# Altium schematic sheet 整板_大板_one.SchDoc
size A0
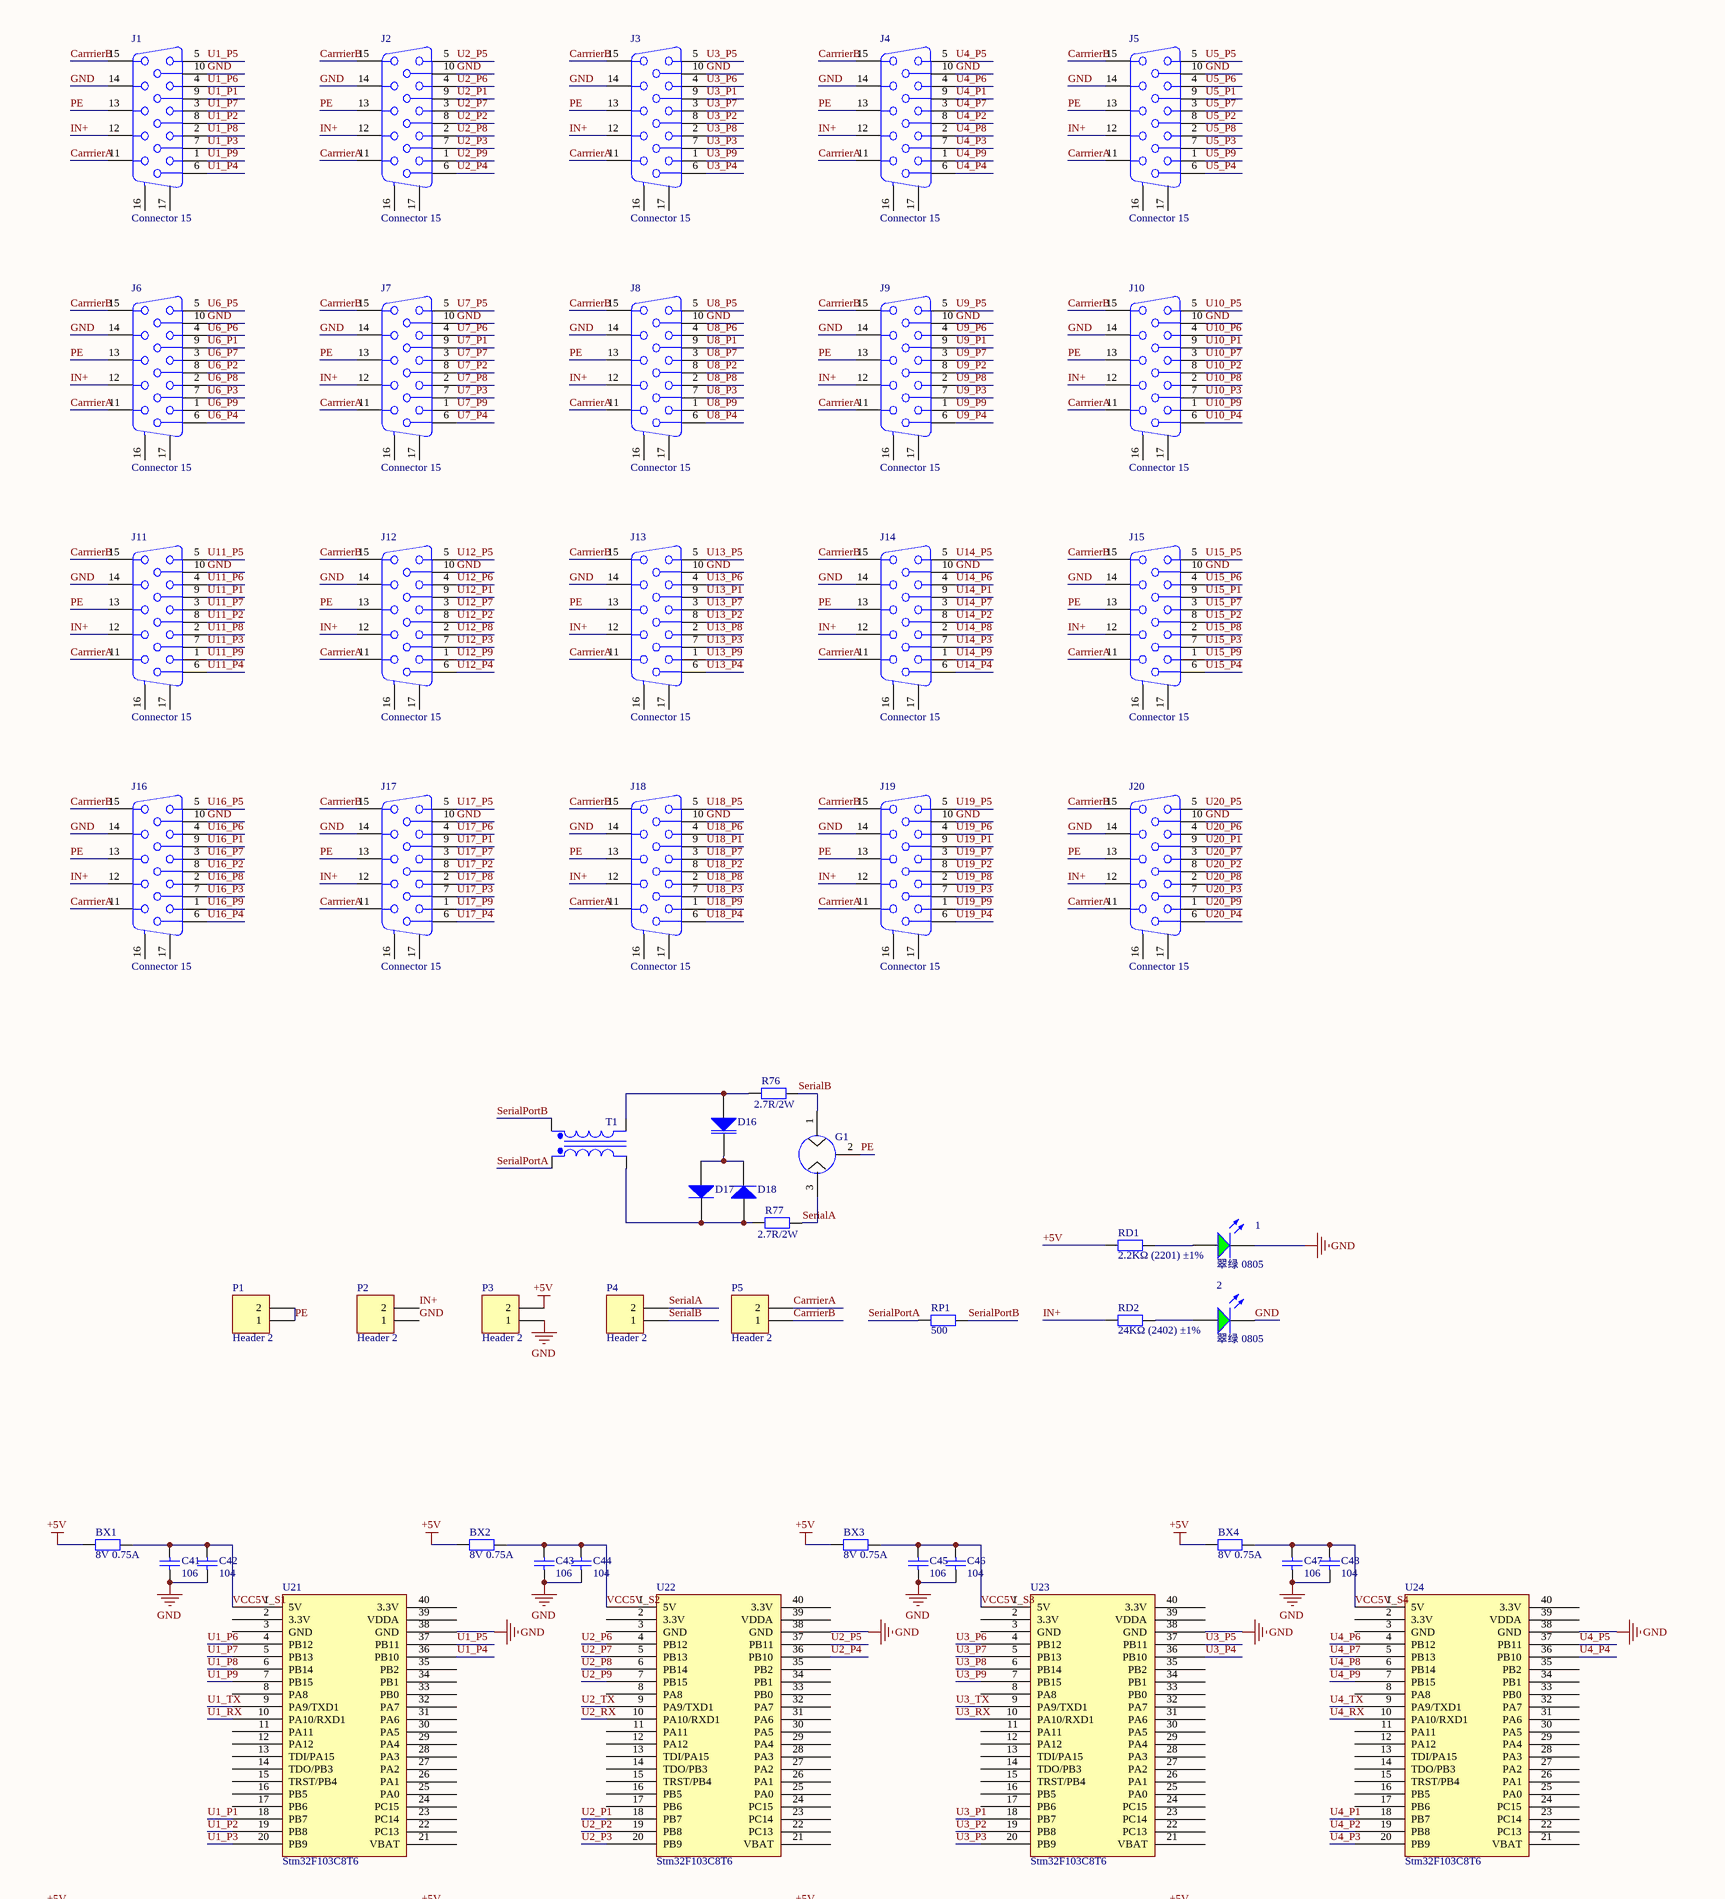
[diagram p0: 整板_大板_one.SchDoc, top left]
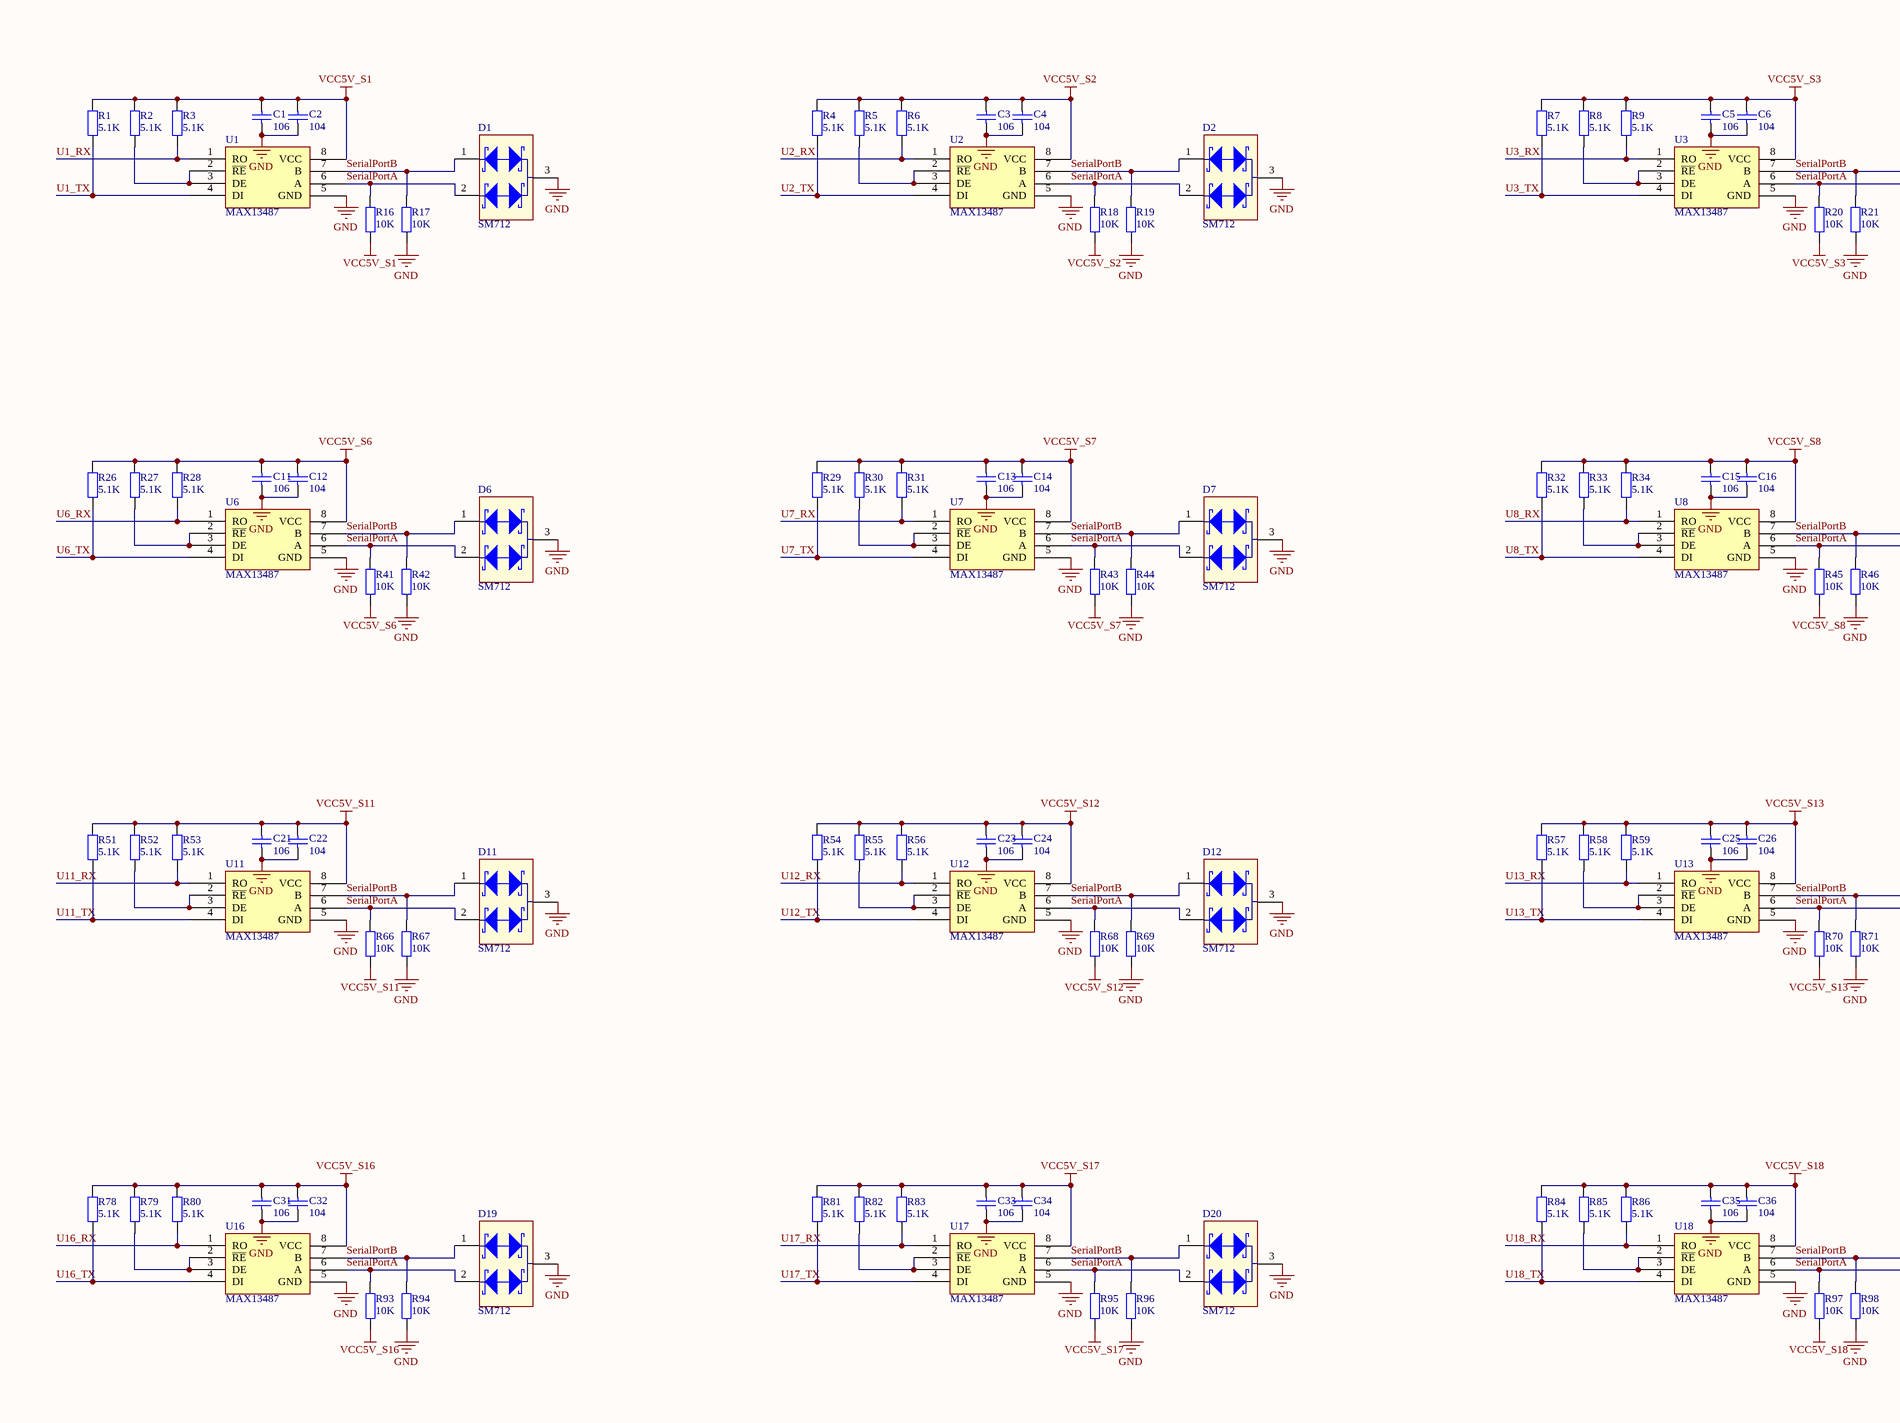
[diagram p1: 整板_大板_one.SchDoc, top middle]
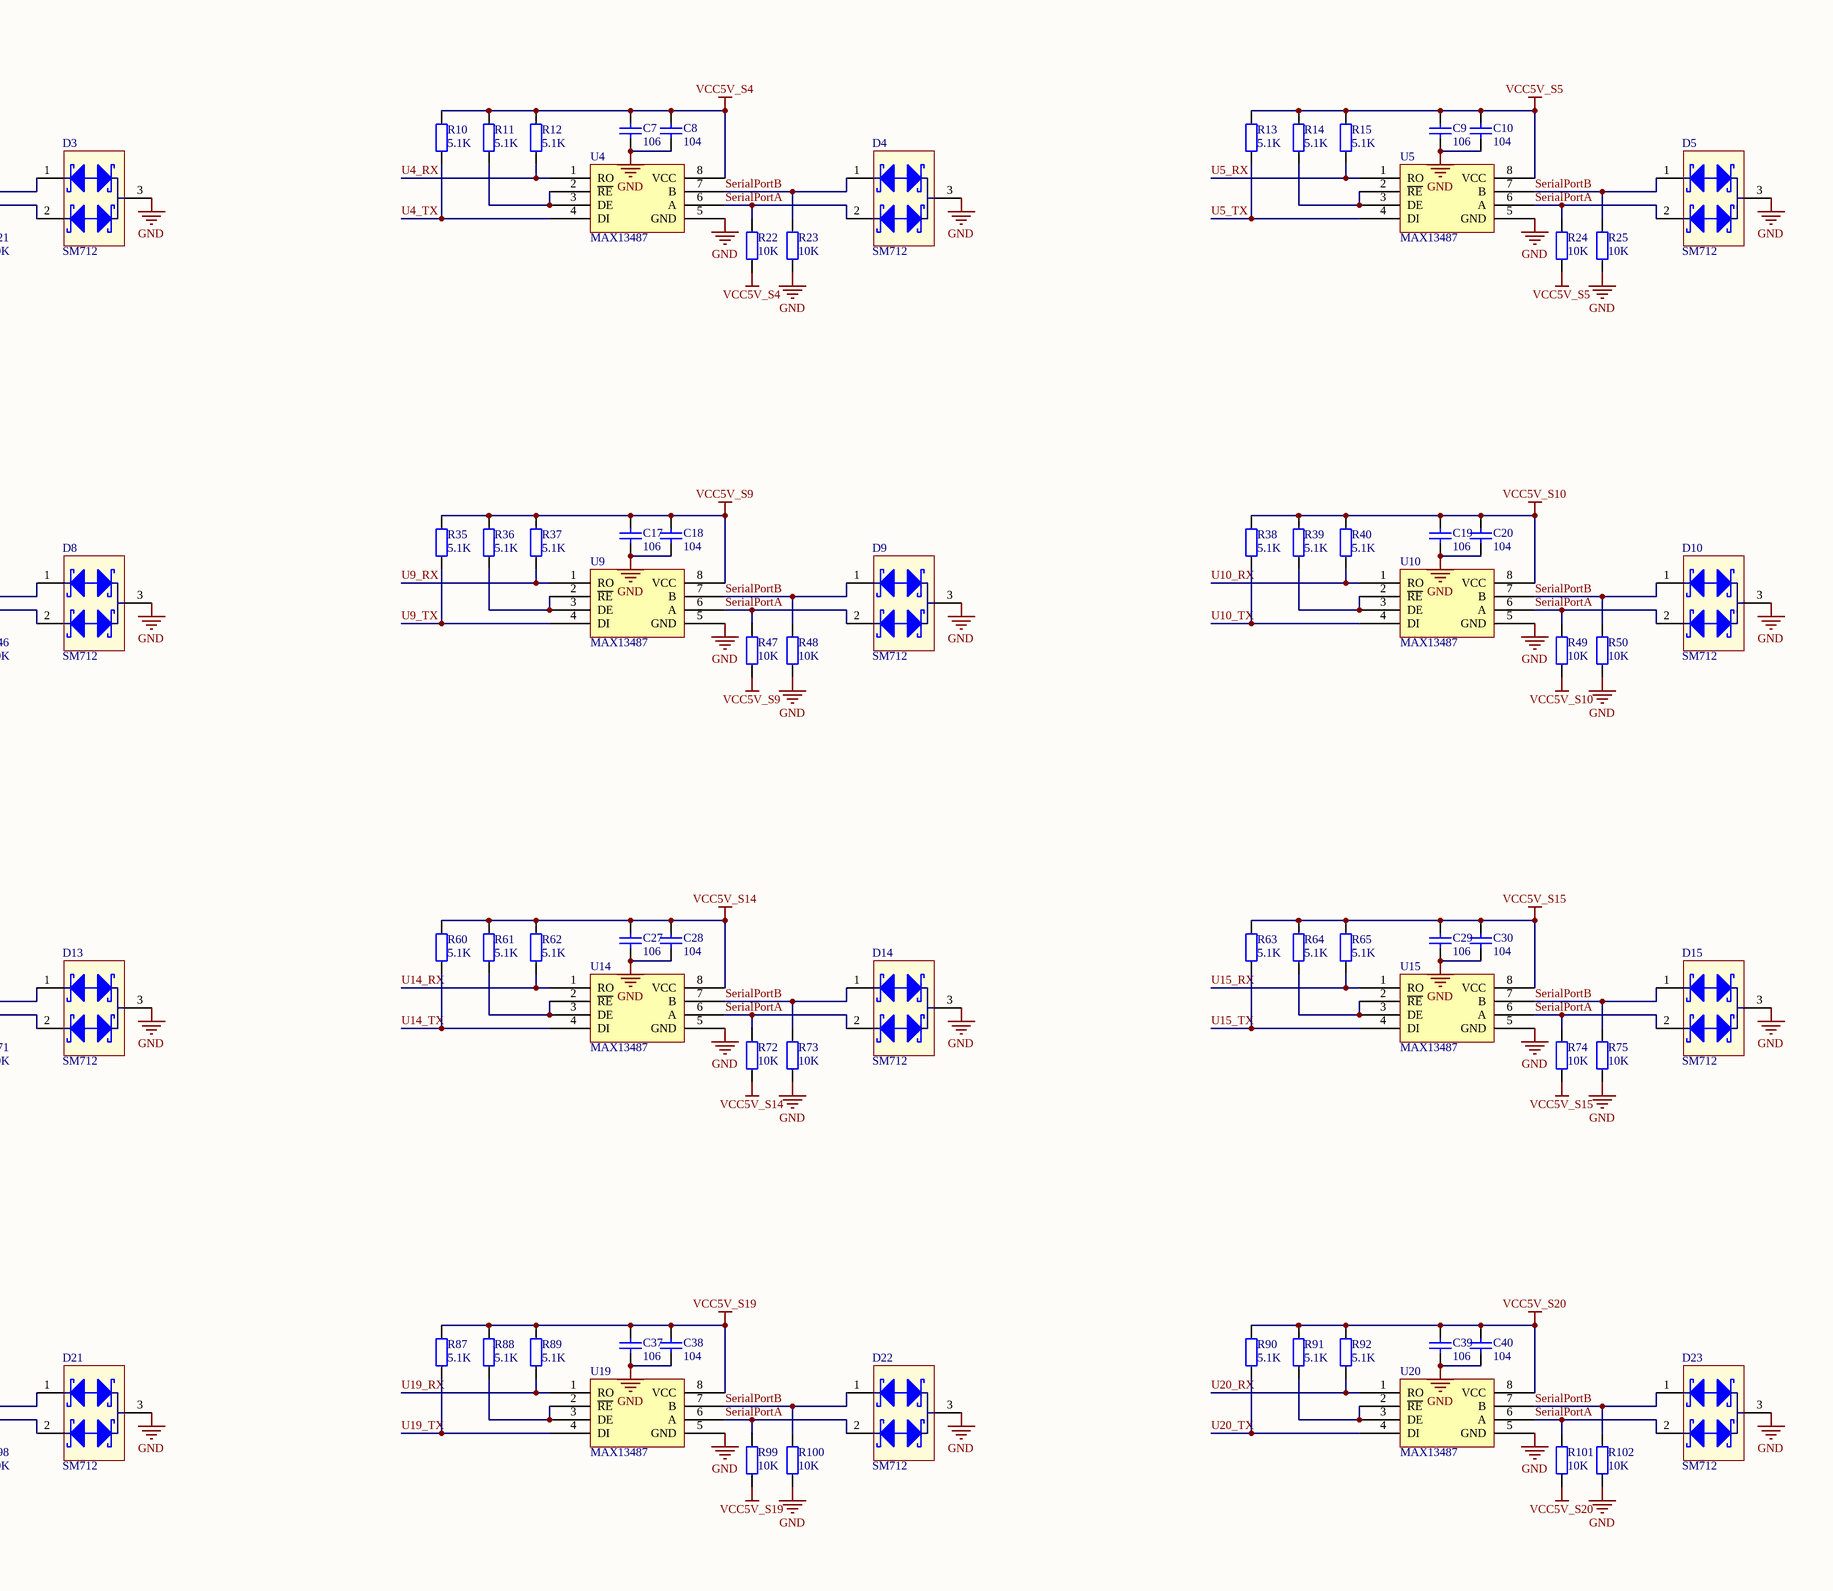
[diagram p2: 整板_大板_one.SchDoc, top right]
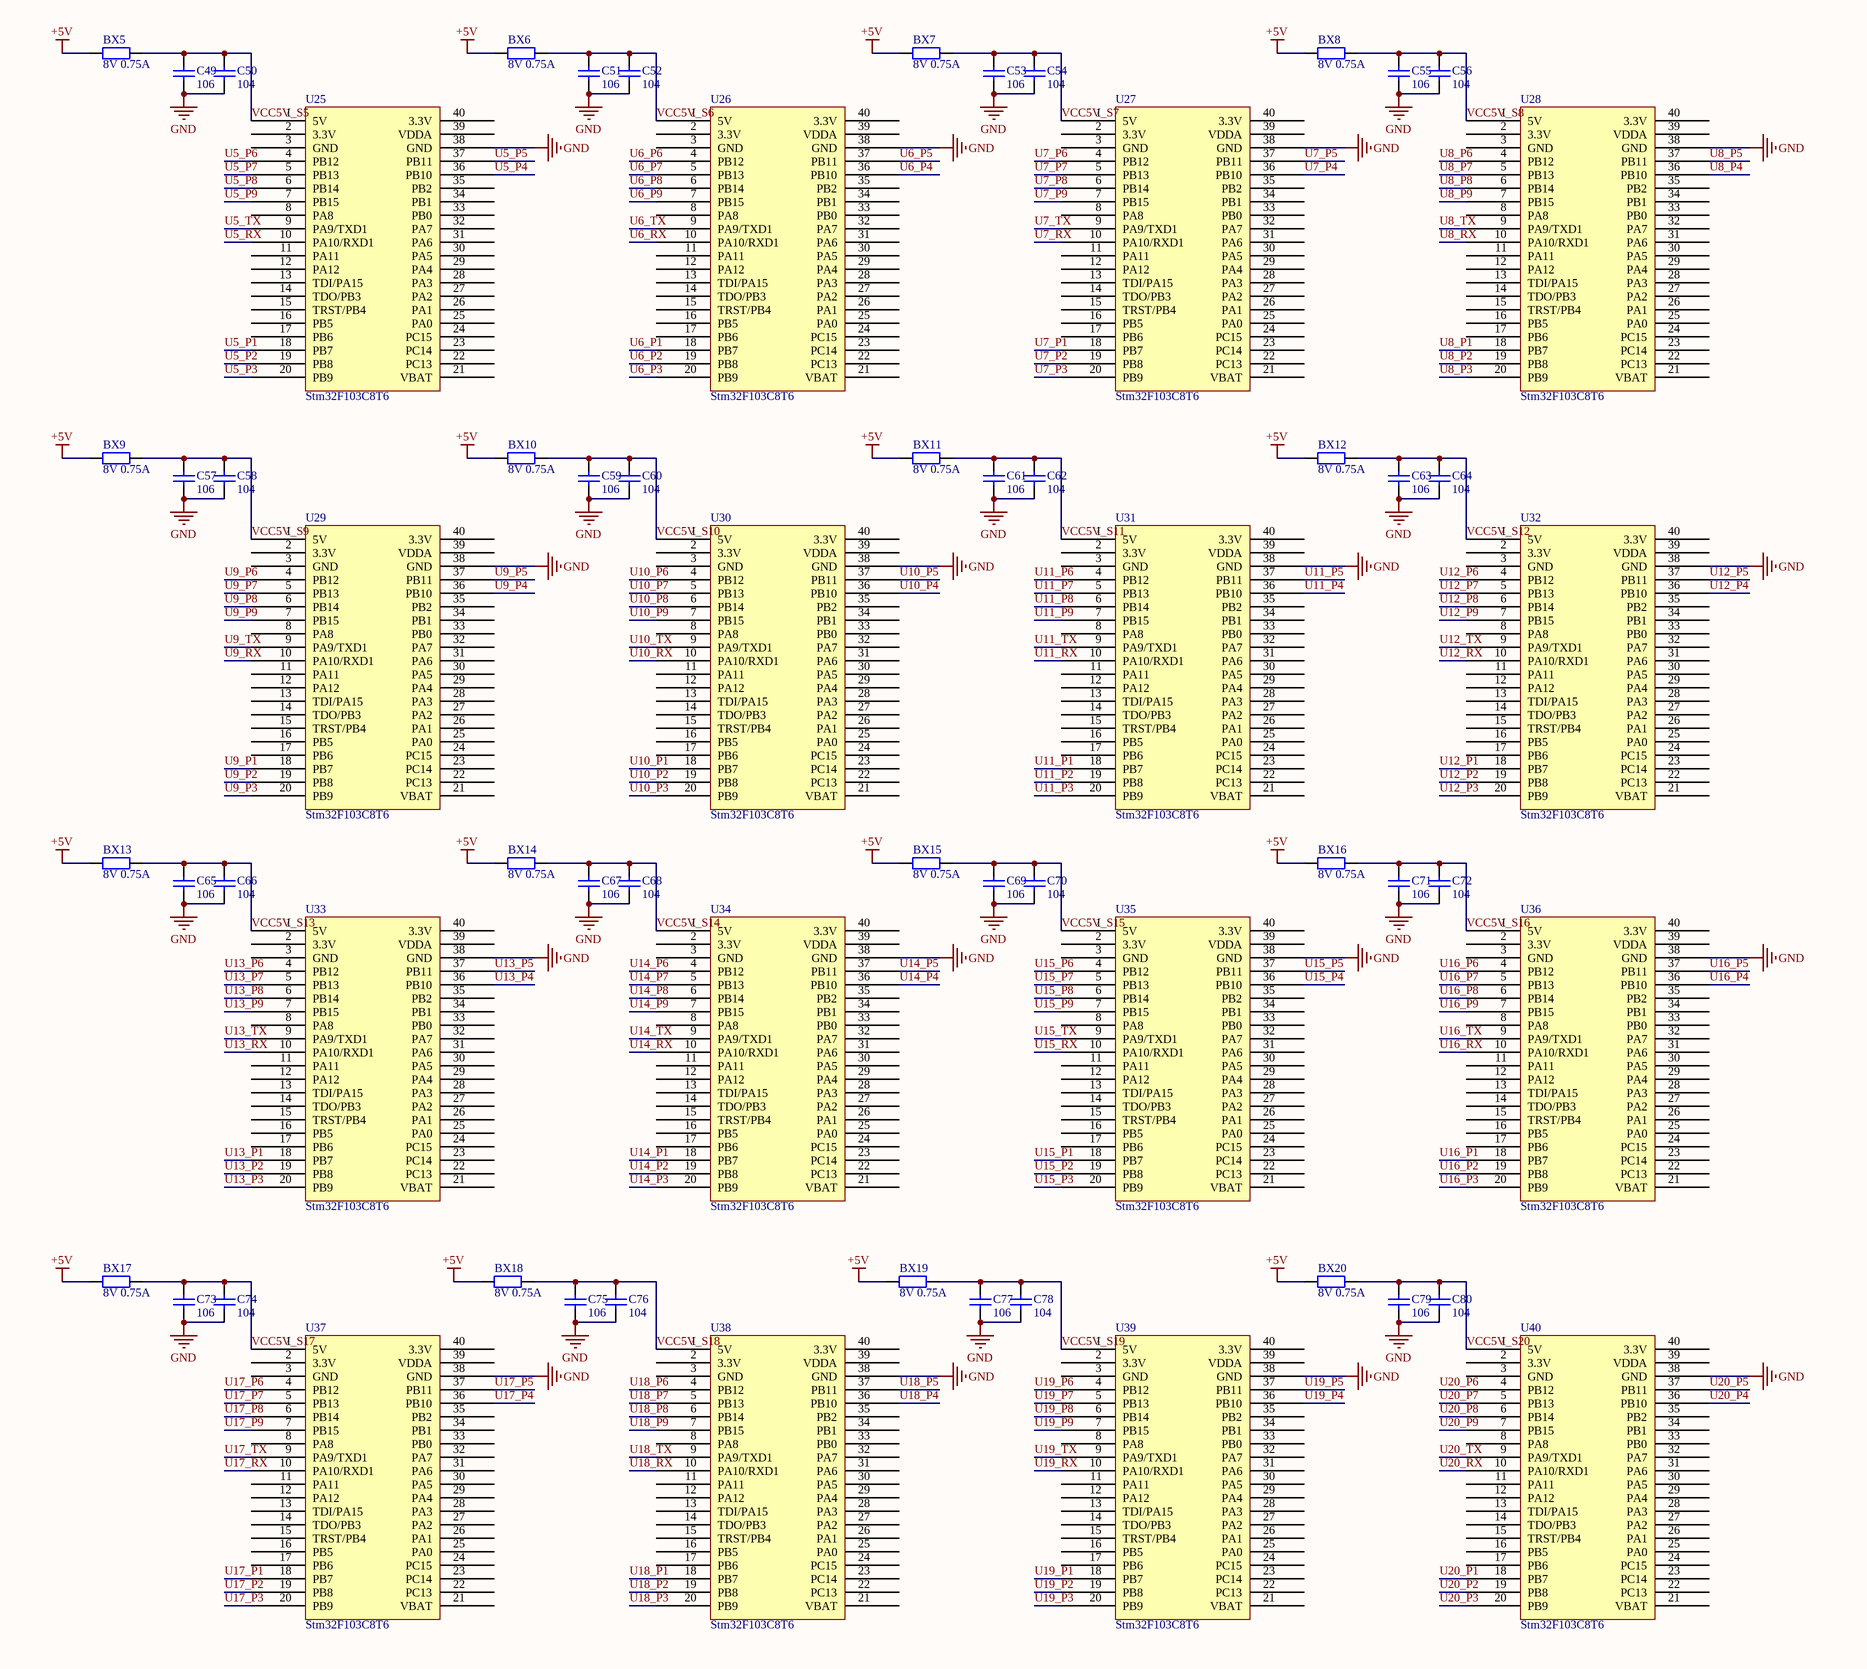
[diagram p3: 整板_大板_one.SchDoc, bottom left]

## Parts
1  翠绿 0805  [0805_LED_S1]
2  翠绿 0805  [0805_LED_S1]
BX1  8V 0.75A  [1206_R]
BX2  8V 0.75A  [1206_R]
BX3  8V 0.75A  [1206_R]
BX4  8V 0.75A  [1206_R]
BX5  8V 0.75A  [1206_R]
BX6  8V 0.75A  [1206_R]
BX7  8V 0.75A  [1206_R]
BX8  8V 0.75A  [1206_R]
BX9  8V 0.75A  [1206_R]
BX10  8V 0.75A  [1206_R]
BX11  8V 0.75A  [1206_R]
BX12  8V 0.75A  [1206_R]
BX13  8V 0.75A  [1206_R]
BX14  8V 0.75A  [1206_R]
BX15  8V 0.75A  [1206_R]
BX16  8V 0.75A  [1206_R]
BX17  8V 0.75A  [1206_R]
BX18  8V 0.75A  [1206_R]
BX19  8V 0.75A  [1206_R]
BX20  8V 0.75A  [1206_R]
C1  value 106  [0805_C]  (hidden comment: Cap Semi)
C2  value 104  [0805_C]  (hidden comment: Cap Semi)
C3  value 106  [0805_C]  (hidden comment: Cap Semi)
C4  value 104  [0805_C]  (hidden comment: Cap Semi)
C5  value 106  [0805_C]  (hidden comment: Cap Semi)
C6  value 104  [0805_C]  (hidden comment: Cap Semi)
C7  value 106  [0805_C]  (hidden comment: Cap Semi)
C8  value 104  [0805_C]  (hidden comment: Cap Semi)
C9  value 106  [0805_C]  (hidden comment: Cap Semi)
C10  value 104  [0805_C]  (hidden comment: Cap Semi)
C11  value 106  [0805_C]  (hidden comment: Cap Semi)
C12  value 104  [0805_C]  (hidden comment: Cap Semi)
C13  value 106  [0805_C]  (hidden comment: Cap Semi)
C14  value 104  [0805_C]  (hidden comment: Cap Semi)
C15  value 106  [0805_C]  (hidden comment: Cap Semi)
C16  value 104  [0805_C]  (hidden comment: Cap Semi)
C17  value 106  [0805_C]  (hidden comment: Cap Semi)
C18  value 104  [0805_C]  (hidden comment: Cap Semi)
C19  value 106  [0805_C]  (hidden comment: Cap Semi)
C20  value 104  [0805_C]  (hidden comment: Cap Semi)
C21  value 106  [0805_C]  (hidden comment: Cap Semi)
C22  value 104  [0805_C]  (hidden comment: Cap Semi)
C23  value 106  [0805_C]  (hidden comment: Cap Semi)
C24  value 104  [0805_C]  (hidden comment: Cap Semi)
C25  value 106  [0805_C]  (hidden comment: Cap Semi)
C26  value 104  [0805_C]  (hidden comment: Cap Semi)
C27  value 106  [0805_C]  (hidden comment: Cap Semi)
C28  value 104  [0805_C]  (hidden comment: Cap Semi)
C29  value 106  [0805_C]  (hidden comment: Cap Semi)
C30  value 104  [0805_C]  (hidden comment: Cap Semi)
C31  value 106  [0805_C]  (hidden comment: Cap Semi)
C32  value 104  [0805_C]  (hidden comment: Cap Semi)
C33  value 106  [0805_C]  (hidden comment: Cap Semi)
C34  value 104  [0805_C]  (hidden comment: Cap Semi)
C35  value 106  [0805_C]  (hidden comment: Cap Semi)
C36  value 104  [0805_C]  (hidden comment: Cap Semi)
C37  value 106  [0805_C]  (hidden comment: Cap Semi)
C38  value 104  [0805_C]  (hidden comment: Cap Semi)
C39  value 106  [0805_C]  (hidden comment: Cap Semi)
C40  value 104  [0805_C]  (hidden comment: Cap Semi)
C41  value 106  [0805_C]  (hidden comment: Cap Semi)
C42  value 104  [0805_C]  (hidden comment: Cap Semi)
C43  value 106  [0805_C]  (hidden comment: Cap Semi)
C44  value 104  [0805_C]  (hidden comment: Cap Semi)
C45  value 106  [0805_C]  (hidden comment: Cap Semi)
C46  value 104  [0805_C]  (hidden comment: Cap Semi)
C47  value 106  [0805_C]  (hidden comment: Cap Semi)
C48  value 104  [0805_C]  (hidden comment: Cap Semi)
C49  value 106  [0805_C]  (hidden comment: Cap Semi)
C50  value 104  [0805_C]  (hidden comment: Cap Semi)
C51  value 106  [0805_C]  (hidden comment: Cap Semi)
C52  value 104  [0805_C]  (hidden comment: Cap Semi)
C53  value 106  [0805_C]  (hidden comment: Cap Semi)
C54  value 104  [0805_C]  (hidden comment: Cap Semi)
C55  value 106  [0805_C]  (hidden comment: Cap Semi)
C56  value 104  [0805_C]  (hidden comment: Cap Semi)
C57  value 106  [0805_C]  (hidden comment: Cap Semi)
C58  value 104  [0805_C]  (hidden comment: Cap Semi)
C59  value 106  [0805_C]  (hidden comment: Cap Semi)
C60  value 104  [0805_C]  (hidden comment: Cap Semi)
C61  value 106  [0805_C]  (hidden comment: Cap Semi)
C62  value 104  [0805_C]  (hidden comment: Cap Semi)
C63  value 106  [0805_C]  (hidden comment: Cap Semi)
C64  value 104  [0805_C]  (hidden comment: Cap Semi)
C65  value 106  [0805_C]  (hidden comment: Cap Semi)
C66  value 104  [0805_C]  (hidden comment: Cap Semi)
C67  value 106  [0805_C]  (hidden comment: Cap Semi)
C68  value 104  [0805_C]  (hidden comment: Cap Semi)
C69  value 106  [0805_C]  (hidden comment: Cap Semi)
C70  value 104  [0805_C]  (hidden comment: Cap Semi)
C71  value 106  [0805_C]  (hidden comment: Cap Semi)
C72  value 104  [0805_C]  (hidden comment: Cap Semi)
C73  value 106  [0805_C]  (hidden comment: Cap Semi)
C74  value 104  [0805_C]  (hidden comment: Cap Semi)
C75  value 106  [0805_C]  (hidden comment: Cap Semi)
C76  value 104  [0805_C]  (hidden comment: Cap Semi)
C77  value 106  [0805_C]  (hidden comment: Cap Semi)
C78  value 104  [0805_C]  (hidden comment: Cap Semi)
C79  value 106  [0805_C]  (hidden comment: Cap Semi)
C80  value 104  [0805_C]  (hidden comment: Cap Semi)
D1  SM712  [SOT-23(SOT-23-3)]
D2  SM712  [SOT-23(SOT-23-3)]
D3  SM712  [SOT-23(SOT-23-3)]
D4  SM712  [SOT-23(SOT-23-3)]
D5  SM712  [SOT-23(SOT-23-3)]
D6  SM712  [SOT-23(SOT-23-3)]
D7  SM712  [SOT-23(SOT-23-3)]
D8  SM712  [SOT-23(SOT-23-3)]
D9  SM712  [SOT-23(SOT-23-3)]
D10  SM712  [SOT-23(SOT-23-3)]
D11  SM712  [SOT-23(SOT-23-3)]
D12  SM712  [SOT-23(SOT-23-3)]
D13  SM712  [SOT-23(SOT-23-3)]
D14  SM712  [SOT-23(SOT-23-3)]
D15  SM712  [SOT-23(SOT-23-3)]
D16  (no value)  [SMBJ8_5CA]
D17  (no value)  [DO-41]
D18  (no value)  [DO-41]
D19  SM712  [SOT-23(SOT-23-3)]
D20  SM712  [SOT-23(SOT-23-3)]
D21  SM712  [SOT-23(SOT-23-3)]
D22  SM712  [SOT-23(SOT-23-3)]
D23  SM712  [SOT-23(SOT-23-3)]
G1  (no value)  [B3D090L-C]
J1  Connector 15  [DB15-PCB]
J2  Connector 15  [DB15-PCB]
J3  Connector 15  [DB15-PCB]
J4  Connector 15  [DB15-PCB]
J5  Connector 15  [DB15-PCB]
J6  Connector 15  [DB15-PCB]
J7  Connector 15  [DB15-PCB]
J8  Connector 15  [DB15-PCB]
J9  Connector 15  [DB15-PCB]
J10  Connector 15  [DB15-PCB]
J11  Connector 15  [DB15-PCB]
J12  Connector 15  [DB15-PCB]
J13  Connector 15  [DB15-PCB]
J14  Connector 15  [DB15-PCB]
J15  Connector 15  [DB15-PCB]
J16  Connector 15  [DB15-PCB]
J17  Connector 15  [DB15-PCB]
J18  Connector 15  [DB15-PCB]
J19  Connector 15  [DB15-PCB]
J20  Connector 15  [DB15-PCB]
P1  Header 2  [弹簧端子-KF242V-5.0-2P]
P2  Header 2  [弹簧端子-KF242V-5.0-2P]
P3  Header 2  [弹簧端子-KF242V-5.0-2P]
P4  Header 2  [弹簧端子-KF242V-5.0-2P]
P5  Header 2  [弹簧端子-KF242V-5.0-2P]
R1  5.1K  [0805_R]
R2  5.1K  [0805_R]
R3  5.1K  [0805_R]
R4  5.1K  [0805_R]
R5  5.1K  [0805_R]
R6  5.1K  [0805_R]
R7  5.1K  [0805_R]
R8  5.1K  [0805_R]
R9  5.1K  [0805_R]
R10  5.1K  [0805_R]
R11  5.1K  [0805_R]
R12  5.1K  [0805_R]
R13  5.1K  [0805_R]
R14  5.1K  [0805_R]
R15  5.1K  [0805_R]
R16  10K  [0805_R]
R17  10K  [0805_R]
R18  10K  [0805_R]
R19  10K  [0805_R]
R20  10K  [0805_R]
R21  10K  [0805_R]
R22  10K  [0805_R]
R23  10K  [0805_R]
R24  10K  [0805_R]
R25  10K  [0805_R]
R26  5.1K  [0805_R]
R27  5.1K  [0805_R]
R28  5.1K  [0805_R]
R29  5.1K  [0805_R]
R30  5.1K  [0805_R]
R31  5.1K  [0805_R]
R32  5.1K  [0805_R]
R33  5.1K  [0805_R]
R34  5.1K  [0805_R]
R35  5.1K  [0805_R]
R36  5.1K  [0805_R]
R37  5.1K  [0805_R]
R38  5.1K  [0805_R]
R39  5.1K  [0805_R]
R40  5.1K  [0805_R]
R41  10K  [0805_R]
R42  10K  [0805_R]
R43  10K  [0805_R]
R44  10K  [0805_R]
R45  10K  [0805_R]
R46  10K  [0805_R]
R47  10K  [0805_R]
R48  10K  [0805_R]
R49  10K  [0805_R]
R50  10K  [0805_R]
R51  5.1K  [0805_R]
R52  5.1K  [0805_R]
R53  5.1K  [0805_R]
R54  5.1K  [0805_R]
R55  5.1K  [0805_R]
R56  5.1K  [0805_R]
R57  5.1K  [0805_R]
R58  5.1K  [0805_R]
R59  5.1K  [0805_R]
R60  5.1K  [0805_R]
R61  5.1K  [0805_R]
R62  5.1K  [0805_R]
R63  5.1K  [0805_R]
R64  5.1K  [0805_R]
R65  5.1K  [0805_R]
R66  10K  [0805_R]
R67  10K  [0805_R]
R68  10K  [0805_R]
R69  10K  [0805_R]
R70  10K  [0805_R]
R71  10K  [0805_R]
R72  10K  [0805_R]
R73  10K  [0805_R]
R74  10K  [0805_R]
R75  10K  [0805_R]
R76  value 2.7R/2W  [1206_R]
R77  value 2.7R/2W  [1206_R]
R78  5.1K  [0805_R]
R79  5.1K  [0805_R]
R80  5.1K  [0805_R]
R81  5.1K  [0805_R]
R82  5.1K  [0805_R]
R83  5.1K  [0805_R]
R84  5.1K  [0805_R]
R85  5.1K  [0805_R]
R86  5.1K  [0805_R]
R87  5.1K  [0805_R]
R88  5.1K  [0805_R]
R89  5.1K  [0805_R]
R90  5.1K  [0805_R]
R91  5.1K  [0805_R]
R92  5.1K  [0805_R]
R93  10K  [0805_R]
R94  10K  [0805_R]
R95  10K  [0805_R]
R96  10K  [0805_R]
R97  10K  [0805_R]
R98  10K  [0805_R]
R99  10K  [0805_R]
R100  10K  [0805_R]
R101  10K  [0805_R]
R102  10K  [0805_R]
RD1  2.2KΩ (2201) ±1%  [0805_R]
RD2  24KΩ (2402) ±1%  [1206_R]
RP1  500  [0805_R]
T1  (no value)  [ACM2520-2P]
U1  MAX13487  [SOIC-8_150mil]
U2  MAX13487  [SOIC-8_150mil]
U3  MAX13487  [SOIC-8_150mil]
U4  MAX13487  [SOIC-8_150mil]
U5  MAX13487  [SOIC-8_150mil]
U6  MAX13487  [SOIC-8_150mil]
U7  MAX13487  [SOIC-8_150mil]
U8  MAX13487  [SOIC-8_150mil]
U9  MAX13487  [SOIC-8_150mil]
U10  MAX13487  [SOIC-8_150mil]
U11  MAX13487  [SOIC-8_150mil]
U12  MAX13487  [SOIC-8_150mil]
U13  MAX13487  [SOIC-8_150mil]
U14  MAX13487  [SOIC-8_150mil]
U15  MAX13487  [SOIC-8_150mil]
U16  MAX13487  [SOIC-8_150mil]
U17  MAX13487  [SOIC-8_150mil]
U18  MAX13487  [SOIC-8_150mil]
U19  MAX13487  [SOIC-8_150mil]
U20  MAX13487  [SOIC-8_150mil]
U21  Stm32F103C8T6  [stm32f103c8t6]
U22  Stm32F103C8T6  [stm32f103c8t6]
U23  Stm32F103C8T6  [stm32f103c8t6]
U24  Stm32F103C8T6  [stm32f103c8t6]
U25  Stm32F103C8T6  [stm32f103c8t6]
U26  Stm32F103C8T6  [stm32f103c8t6]
U27  Stm32F103C8T6  [stm32f103c8t6]
U28  Stm32F103C8T6  [stm32f103c8t6]
U29  Stm32F103C8T6  [stm32f103c8t6]
U30  Stm32F103C8T6  [stm32f103c8t6]
U31  Stm32F103C8T6  [stm32f103c8t6]
U32  Stm32F103C8T6  [stm32f103c8t6]
U33  Stm32F103C8T6  [stm32f103c8t6]
U34  Stm32F103C8T6  [stm32f103c8t6]
U35  Stm32F103C8T6  [stm32f103c8t6]
U36  Stm32F103C8T6  [stm32f103c8t6]
U37  Stm32F103C8T6  [stm32f103c8t6]
U38  Stm32F103C8T6  [stm32f103c8t6]
U39  Stm32F103C8T6  [stm32f103c8t6]
U40  Stm32F103C8T6  [stm32f103c8t6]

## Nets
+5V: BX1.1 BX2.1 BX3.1 BX4.1 BX5.1 BX6.1 BX7.1 BX8.1 BX9.1 BX10.1 BX11.1 BX12.1 BX13.1 BX14.1 BX15.1 BX16.1 BX17.1 BX18.1 BX19.1 BX20.1 P3.2 RD1.2
GND: 1.K 2.K C1.2 C2.2 C3.2 C4.2 C5.2 C6.2 C7.2 C8.2 C9.2 C10.2 C11.2 C12.2 C13.2 C14.2 C15.2 C16.2 C17.2 C18.2 C19.2 C20.2 C21.2 C22.2 C23.2 C24.2 C25.2 C26.2 C27.2 C28.2 C29.2 C30.2 C31.2 C32.2 C33.2 C34.2 C35.2 C36.2 C37.2 C38.2 C39.2 C40.2 C41.2 C42.2 C43.2 C44.2 C45.2 C46.2 C47.2 C48.2 C49.2 C50.2 C51.2 C52.2 C53.2 C54.2 C55.2 C56.2 C57.2 C58.2 C59.2 C60.2 C61.2 C62.2 C63.2 C64.2 C65.2 C66.2 C67.2 C68.2 C69.2 C70.2 C71.2 C72.2 C73.2 C74.2 C75.2 C76.2 C77.2 C78.2 C79.2 C80.2 D1.3 D2.3 D3.3 D4.3 D5.3 D6.3 D7.3 D8.3 D9.3 D10.3 D11.3 D12.3 D13.3 D14.3 D15.3 D19.3 D20.3 D21.3 D22.3 D23.3 J1.10 J1.14 J2.10 J2.14 J3.10 J3.14 J4.10 J4.14 J5.10 J5.14 J6.10 J6.14 J7.10 J7.14 J8.10 J8.14 J9.10 J9.14 J10.10 J10.14 J11.10 J11.14 J12.10 J12.14 J13.10 J13.14 J14.10 J14.14 J15.10 J15.14 J16.10 J16.14 J17.10 J17.14 J18.10 J18.14 J19.10 J19.14 J20.10 J20.14 P2.1 P3.1 R17.2 R19.2 R21.2 R23.2 R25.2 R42.2 R44.2 R46.2 R48.2 R50.2 R67.2 R69.2 R71.2 R73.2 R75.2 R94.2 R96.2 R98.2 R100.2 R102.2 U1.5(GND) U2.5(GND) U3.5(GND) U4.5(GND) U5.5(GND) U6.5(GND) U7.5(GND) U8.5(GND) U9.5(GND) U10.5(GND) U11.5(GND) U12.5(GND) U13.5(GND) U14.5(GND) U15.5(GND) U16.5(GND) U17.5(GND) U18.5(GND) U19.5(GND) U20.5(GND) U21.38(GND) U22.38(GND) U23.38(GND) U24.38(GND) U25.38(GND) U26.38(GND) U27.38(GND) U28.38(GND) U29.38(GND) U30.38(GND) U31.38(GND) U32.38(GND) U33.38(GND) U34.38(GND) U35.38(GND) U36.38(GND) U37.38(GND) U38.38(GND) U39.38(GND) U40.38(GND)
VCC5V_S1: BX1.2 C1.1 C2.1 C41.1 C42.1 R1.2 R2.2 R3.2 R16.1 U1.8(VCC) U21.1(5V)
VCC5V_S2: BX2.2 C3.1 C4.1 C43.1 C44.1 R4.2 R5.2 R6.2 R18.1 U2.8(VCC) U22.1(5V)
VCC5V_S3: BX3.2 C5.1 C6.1 C45.1 C46.1 R7.2 R8.2 R9.2 R20.1 U3.8(VCC) U23.1(5V)
VCC5V_S4: BX4.2 C7.1 C8.1 C47.1 C48.1 R10.2 R11.2 R12.2 R22.1 U4.8(VCC) U24.1(5V)
VCC5V_S5: BX5.2 C9.1 C10.1 C49.1 C50.1 R13.2 R14.2 R15.2 R24.1 U5.8(VCC) U25.1(5V)
VCC5V_S6: BX6.2 C11.1 C12.1 C51.1 C52.1 R26.2 R27.2 R28.2 R41.1 U6.8(VCC) U26.1(5V)
VCC5V_S7: BX7.2 C13.1 C14.1 C53.1 C54.1 R29.2 R30.2 R31.2 R43.1 U7.8(VCC) U27.1(5V)
VCC5V_S8: BX8.2 C15.1 C16.1 C55.1 C56.1 R32.2 R33.2 R34.2 R45.1 U8.8(VCC) U28.1(5V)
VCC5V_S9: BX9.2 C17.1 C18.1 C57.1 C58.1 R35.2 R36.2 R37.2 R47.1 U9.8(VCC) U29.1(5V)
VCC5V_S10: BX10.2 C19.1 C20.1 C59.1 C60.1 R38.2 R39.2 R40.2 R49.1 U10.8(VCC) U30.1(5V)
VCC5V_S11: BX11.2 C21.1 C22.1 C61.1 C62.1 R51.2 R52.2 R53.2 R66.1 U11.8(VCC) U31.1(5V)
VCC5V_S12: BX12.2 C23.1 C24.1 C63.1 C64.1 R54.2 R55.2 R56.2 R68.1 U12.8(VCC) U32.1(5V)
VCC5V_S13: BX13.2 C25.1 C26.1 C65.1 C66.1 R57.2 R58.2 R59.2 R70.1 U13.8(VCC) U33.1(5V)
VCC5V_S14: BX14.2 C27.1 C28.1 C67.1 C68.1 R60.2 R61.2 R62.2 R72.1 U14.8(VCC) U34.1(5V)
VCC5V_S15: BX15.2 C29.1 C30.1 C69.1 C70.1 R63.2 R64.2 R65.2 R74.1 U15.8(VCC) U35.1(5V)
VCC5V_S16: BX16.2 C31.1 C32.1 C71.1 C72.1 R78.2 R79.2 R80.2 R93.1 U16.8(VCC) U36.1(5V)
VCC5V_S17: BX17.2 C33.1 C34.1 C73.1 C74.1 R81.2 R82.2 R83.2 R95.1 U17.8(VCC) U37.1(5V)
VCC5V_S18: BX18.2 C35.1 C36.1 C75.1 C76.1 R84.2 R85.2 R86.2 R97.1 U18.8(VCC) U38.1(5V)
VCC5V_S19: BX19.2 C37.1 C38.1 C77.1 C78.1 R87.2 R88.2 R89.2 R99.1 U19.8(VCC) U39.1(5V)
VCC5V_S20: BX20.2 C39.1 C40.1 C79.1 C80.1 R90.2 R91.2 R92.2 R101.1 U20.8(VCC) U40.1(5V)
CarrrierA: J1.11 J2.11 J3.11 J4.11 J5.11 J6.11 J7.11 J8.11 J9.11 J10.11 J11.11 J12.11 J13.11 J14.11 J15.11 J16.11 J17.11 J18.11 J19.11 J20.11 P5.2
CarrrierB: J1.15 J2.15 J3.15 J4.15 J5.15 J6.15 J7.15 J8.15 J9.15 J10.15 J11.15 J12.15 J13.15 J14.15 J15.15 J16.15 J17.15 J18.15 J19.15 J20.15 P5.1
IN+: J1.12 J2.12 J3.12 J4.12 J5.12 J6.12 J7.12 J8.12 J9.12 J10.12 J11.12 J12.12 J13.12 J14.12 J15.12 J16.12 J17.12 J18.12 J19.12 J20.12 P2.2 RD2.2
PE: G1.2 J1.13 J2.13 J3.13 J4.13 J5.13 J6.13 J7.13 J8.13 J9.13 J10.13 J11.13 J12.13 J13.13 J14.13 J15.13 J16.13 J17.13 J18.13 J19.13 J20.13 P1.1 P1.2
SerialA: G1.3 P4.2 R77.2
SerialB: G1.1 P4.1 R76.2
SerialPortA: D1.2(GND) D2.2(GND) D3.2(GND) D4.2(GND) D5.2(GND) D6.2(GND) D7.2(GND) D8.2(GND) D9.2(GND) D10.2(GND) D11.2(GND) D12.2(GND) D13.2(GND) D14.2(GND) D15.2(GND) D19.2(GND) D20.2(GND) D21.2(GND) D22.2(GND) D23.2(GND) R16.2 R18.2 R20.2 R22.2 R24.2 R41.2 R43.2 R45.2 R47.2 R49.2 R66.2 R68.2 R70.2 R72.2 R74.2 R93.2 R95.2 R97.2 R99.2 R101.2 RP1.2 T1.2(Pri+) U1.6(A) U2.6(A) U3.6(A) U4.6(A) U5.6(A) U6.6(A) U7.6(A) U8.6(A) U9.6(A) U10.6(A) U11.6(A) U12.6(A) U13.6(A) U14.6(A) U15.6(A) U16.6(A) U17.6(A) U18.6(A) U19.6(A) U20.6(A)
SerialPortB: D1.1 D2.1 D3.1 D4.1 D5.1 D6.1 D7.1 D8.1 D9.1 D10.1 D11.1 D12.1 D13.1 D14.1 D15.1 D19.1 D20.1 D21.1 D22.1 D23.1 R17.1 R19.1 R21.1 R23.1 R25.1 R42.1 R44.1 R46.1 R48.1 R50.1 R67.1 R69.1 R71.1 R73.1 R75.1 R94.1 R96.1 R98.1 R100.1 R102.1 RP1.1 T1.1(Sec+) U1.7(B) U2.7(B) U3.7(B) U4.7(B) U5.7(B) U6.7(B) U7.7(B) U8.7(B) U9.7(B) U10.7(B) U11.7(B) U12.7(B) U13.7(B) U14.7(B) U15.7(B) U16.7(B) U17.7(B) U18.7(B) U19.7(B) U20.7(B)
U1_P1: J1.9 U21.18(PB7)
U1_P2: J1.8 U21.19(PB8)
U1_P3: J1.7 U21.20(PB9)
U1_P4: J1.6 U21.36(PB10)
U1_P5: J1.5 U21.37(PB11)
U1_P6: J1.4 U21.4(PB12)
U1_P7: J1.3 U21.5(PB13)
U1_P8: J1.2 U21.6(PB14)
U1_P9: J1.1 U21.7(PB15)
U1_RX: R3.1 U1.1(RO) U21.10(PA10/RXD1)
U1_TX: R1.1 U1.4(DI) U21.9(PA9/TXD1)
U2_P1: J2.9 U22.18(PB7)
U2_P2: J2.8 U22.19(PB8)
U2_P3: J2.7 U22.20(PB9)
U2_P4: J2.6 U22.36(PB10)
U2_P5: J2.5 U22.37(PB11)
U2_P6: J2.4 U22.4(PB12)
U2_P7: J2.3 U22.5(PB13)
U2_P8: J2.2 U22.6(PB14)
U2_P9: J2.1 U22.7(PB15)
U2_RX: R6.1 U2.1(RO) U22.10(PA10/RXD1)
U2_TX: R4.1 U2.4(DI) U22.9(PA9/TXD1)
U3_P1: J3.9 U23.18(PB7)
U3_P2: J3.8 U23.19(PB8)
U3_P3: J3.7 U23.20(PB9)
U3_P4: J3.6 U23.36(PB10)
U3_P5: J3.5 U23.37(PB11)
U3_P6: J3.4 U23.4(PB12)
U3_P7: J3.3 U23.5(PB13)
U3_P8: J3.2 U23.6(PB14)
U3_P9: J3.1 U23.7(PB15)
U3_RX: R9.1 U3.1(RO) U23.10(PA10/RXD1)
U3_TX: R7.1 U3.4(DI) U23.9(PA9/TXD1)
U4_P1: J4.9 U24.18(PB7)
U4_P2: J4.8 U24.19(PB8)
U4_P3: J4.7 U24.20(PB9)
U4_P4: J4.6 U24.36(PB10)
U4_P5: J4.5 U24.37(PB11)
U4_P6: J4.4 U24.4(PB12)
U4_P7: J4.3 U24.5(PB13)
U4_P8: J4.2 U24.6(PB14)
U4_P9: J4.1 U24.7(PB15)
U4_RX: R12.1 U4.1(RO) U24.10(PA10/RXD1)
U4_TX: R10.1 U4.4(DI) U24.9(PA9/TXD1)
U5_P1: J5.9 U25.18(PB7)
U5_P2: J5.8 U25.19(PB8)
U5_P3: J5.7 U25.20(PB9)
U5_P4: J5.6 U25.36(PB10)
U5_P5: J5.5 U25.37(PB11)
U5_P6: J5.4 U25.4(PB12)
U5_P7: J5.3 U25.5(PB13)
U5_P8: J5.2 U25.6(PB14)
U5_P9: J5.1 U25.7(PB15)
U5_RX: R15.1 U5.1(RO) U25.10(PA10/RXD1)
U5_TX: R13.1 U5.4(DI) U25.9(PA9/TXD1)
U6_P1: J6.9 U26.18(PB7)
U6_P2: J6.8 U26.19(PB8)
U6_P3: J6.7 U26.20(PB9)
U6_P4: J6.6 U26.36(PB10)
U6_P5: J6.5 U26.37(PB11)
U6_P6: J6.4 U26.4(PB12)
U6_P7: J6.3 U26.5(PB13)
U6_P8: J6.2 U26.6(PB14)
U6_P9: J6.1 U26.7(PB15)
U6_RX: R28.1 U6.1(RO) U26.10(PA10/RXD1)
U6_TX: R26.1 U6.4(DI) U26.9(PA9/TXD1)
U7_P1: J7.9 U27.18(PB7)
U7_P2: J7.8 U27.19(PB8)
U7_P3: J7.7 U27.20(PB9)
U7_P4: J7.6 U27.36(PB10)
U7_P5: J7.5 U27.37(PB11)
U7_P6: J7.4 U27.4(PB12)
U7_P7: J7.3 U27.5(PB13)
U7_P8: J7.2 U27.6(PB14)
U7_P9: J7.1 U27.7(PB15)
U7_RX: R31.1 U7.1(RO) U27.10(PA10/RXD1)
U7_TX: R29.1 U7.4(DI) U27.9(PA9/TXD1)
U8_P1: J8.9 U28.18(PB7)
U8_P2: J8.8 U28.19(PB8)
U8_P3: J8.7 U28.20(PB9)
U8_P4: J8.6 U28.36(PB10)
U8_P5: J8.5 U28.37(PB11)
U8_P6: J8.4 U28.4(PB12)
U8_P7: J8.3 U28.5(PB13)
U8_P8: J8.2 U28.6(PB14)
U8_P9: J8.1 U28.7(PB15)
U8_RX: R34.1 U8.1(RO) U28.10(PA10/RXD1)
U8_TX: R32.1 U8.4(DI) U28.9(PA9/TXD1)
U9_P1: J9.9 U29.18(PB7)
U9_P2: J9.8 U29.19(PB8)
U9_P3: J9.7 U29.20(PB9)
U9_P4: J9.6 U29.36(PB10)
U9_P5: J9.5 U29.37(PB11)
U9_P6: J9.4 U29.4(PB12)
U9_P7: J9.3 U29.5(PB13)
U9_P8: J9.2 U29.6(PB14)
U9_P9: J9.1 U29.7(PB15)
U9_RX: R37.1 U9.1(RO) U29.10(PA10/RXD1)
U9_TX: R35.1 U9.4(DI) U29.9(PA9/TXD1)
U10_P1: J10.9 U30.18(PB7)
U10_P2: J10.8 U30.19(PB8)
U10_P3: J10.7 U30.20(PB9)
U10_P4: J10.6 U30.36(PB10)
U10_P5: J10.5 U30.37(PB11)
U10_P6: J10.4 U30.4(PB12)
U10_P7: J10.3 U30.5(PB13)
U10_P8: J10.2 U30.6(PB14)
U10_P9: J10.1 U30.7(PB15)
U10_RX: R40.1 U10.1(RO) U30.10(PA10/RXD1)
U10_TX: R38.1 U10.4(DI) U30.9(PA9/TXD1)
U11_P1: J11.9 U31.18(PB7)
U11_P2: J11.8 U31.19(PB8)
U11_P3: J11.7 U31.20(PB9)
U11_P4: J11.6 U31.36(PB10)
U11_P5: J11.5 U31.37(PB11)
U11_P6: J11.4 U31.4(PB12)
U11_P7: J11.3 U31.5(PB13)
U11_P8: J11.2 U31.6(PB14)
U11_P9: J11.1 U31.7(PB15)
U11_RX: R53.1 U11.1(RO) U31.10(PA10/RXD1)
U11_TX: R51.1 U11.4(DI) U31.9(PA9/TXD1)
U12_P1: J12.9 U32.18(PB7)
U12_P2: J12.8 U32.19(PB8)
U12_P3: J12.7 U32.20(PB9)
U12_P4: J12.6 U32.36(PB10)
U12_P5: J12.5 U32.37(PB11)
U12_P6: J12.4 U32.4(PB12)
U12_P7: J12.3 U32.5(PB13)
U12_P8: J12.2 U32.6(PB14)
U12_P9: J12.1 U32.7(PB15)
U12_RX: R56.1 U12.1(RO) U32.10(PA10/RXD1)
U12_TX: R54.1 U12.4(DI) U32.9(PA9/TXD1)
U13_P1: J13.9 U33.18(PB7)
U13_P2: J13.8 U33.19(PB8)
U13_P3: J13.7 U33.20(PB9)
U13_P4: J13.6 U33.36(PB10)
U13_P5: J13.5 U33.37(PB11)
U13_P6: J13.4 U33.4(PB12)
U13_P7: J13.3 U33.5(PB13)
U13_P8: J13.2 U33.6(PB14)
U13_P9: J13.1 U33.7(PB15)
U13_RX: R59.1 U13.1(RO) U33.10(PA10/RXD1)
U13_TX: R57.1 U13.4(DI) U33.9(PA9/TXD1)
U14_P1: J14.9 U34.18(PB7)
U14_P2: J14.8 U34.19(PB8)
U14_P3: J14.7 U34.20(PB9)
U14_P4: J14.6 U34.36(PB10)
U14_P5: J14.5 U34.37(PB11)
U14_P6: J14.4 U34.4(PB12)
U14_P7: J14.3 U34.5(PB13)
U14_P8: J14.2 U34.6(PB14)
U14_P9: J14.1 U34.7(PB15)
U14_RX: R62.1 U14.1(RO) U34.10(PA10/RXD1)
U14_TX: R60.1 U14.4(DI) U34.9(PA9/TXD1)
U15_P1: J15.9 U35.18(PB7)
U15_P2: J15.8 U35.19(PB8)
U15_P3: J15.7 U35.20(PB9)
U15_P4: J15.6 U35.36(PB10)
U15_P5: J15.5 U35.37(PB11)
U15_P6: J15.4 U35.4(PB12)
U15_P7: J15.3 U35.5(PB13)
U15_P8: J15.2 U35.6(PB14)
U15_P9: J15.1 U35.7(PB15)
U15_RX: R65.1 U15.1(RO) U35.10(PA10/RXD1)
U15_TX: R63.1 U15.4(DI) U35.9(PA9/TXD1)
U16_P1: J16.9 U36.18(PB7)
U16_P2: J16.8 U36.19(PB8)
U16_P3: J16.7 U36.20(PB9)
U16_P4: J16.6 U36.36(PB10)
U16_P5: J16.5 U36.37(PB11)
U16_P6: J16.4 U36.4(PB12)
U16_P7: J16.3 U36.5(PB13)
U16_P8: J16.2 U36.6(PB14)
U16_P9: J16.1 U36.7(PB15)
U16_RX: R80.1 U16.1(RO) U36.10(PA10/RXD1)
U16_TX: R78.1 U16.4(DI) U36.9(PA9/TXD1)
U17_P1: J17.9 U37.18(PB7)
U17_P2: J17.8 U37.19(PB8)
U17_P3: J17.7 U37.20(PB9)
U17_P4: J17.6 U37.36(PB10)
U17_P5: J17.5 U37.37(PB11)
U17_P6: J17.4 U37.4(PB12)
U17_P7: J17.3 U37.5(PB13)
U17_P8: J17.2 U37.6(PB14)
U17_P9: J17.1 U37.7(PB15)
U17_RX: R83.1 U17.1(RO) U37.10(PA10/RXD1)
U17_TX: R81.1 U17.4(DI) U37.9(PA9/TXD1)
U18_P1: J18.9 U38.18(PB7)
U18_P2: J18.8 U38.19(PB8)
U18_P3: J18.7 U38.20(PB9)
U18_P4: J18.6 U38.36(PB10)
U18_P5: J18.5 U38.37(PB11)
U18_P6: J18.4 U38.4(PB12)
U18_P7: J18.3 U38.5(PB13)
U18_P8: J18.2 U38.6(PB14)
U18_P9: J18.1 U38.7(PB15)
U18_RX: R86.1 U18.1(RO) U38.10(PA10/RXD1)
U18_TX: R84.1 U18.4(DI) U38.9(PA9/TXD1)
U19_P1: J19.9 U39.18(PB7)
U19_P2: J19.8 U39.19(PB8)
U19_P3: J19.7 U39.20(PB9)
U19_P4: J19.6 U39.36(PB10)
U19_P5: J19.5 U39.37(PB11)
U19_P6: J19.4 U39.4(PB12)
U19_P7: J19.3 U39.5(PB13)
U19_P8: J19.2 U39.6(PB14)
U19_P9: J19.1 U39.7(PB15)
U19_RX: R89.1 U19.1(RO) U39.10(PA10/RXD1)
U19_TX: R87.1 U19.4(DI) U39.9(PA9/TXD1)
U20_P1: J20.9 U40.18(PB7)
U20_P2: J20.8 U40.19(PB8)
U20_P3: J20.7 U40.20(PB9)
U20_P4: J20.6 U40.36(PB10)
U20_P5: J20.5 U40.37(PB11)
U20_P6: J20.4 U40.4(PB12)
U20_P7: J20.3 U40.5(PB13)
U20_P8: J20.2 U40.6(PB14)
U20_P9: J20.1 U40.7(PB15)
U20_RX: R92.1 U20.1(RO) U40.10(PA10/RXD1)
U20_TX: R90.1 U20.4(DI) U40.9(PA9/TXD1)
Net1_A: 1.A RD1.1
Net2_A: 2.A RD2.1
NetD16_1: D16.1(K) D17.1(A) D18.2(K)
NetD16_2: D16.2(A) R76.1 T1.4(Sec-)
NetD17_2: D17.2(K) D18.1(A) R77.1 T1.3(Pri-)
NetR2_1: R2.1 U1.2(~{RE}) U1.3(DE)
NetR5_1: R5.1 U2.2(~{RE}) U2.3(DE)
NetR8_1: R8.1 U3.2(~{RE}) U3.3(DE)
NetR11_1: R11.1 U4.2(~{RE}) U4.3(DE)
NetR14_1: R14.1 U5.2(~{RE}) U5.3(DE)
NetR27_1: R27.1 U6.2(~{RE}) U6.3(DE)
NetR30_1: R30.1 U7.2(~{RE}) U7.3(DE)
NetR33_1: R33.1 U8.2(~{RE}) U8.3(DE)
NetR36_1: R36.1 U9.2(~{RE}) U9.3(DE)
NetR39_1: R39.1 U10.2(~{RE}) U10.3(DE)
NetR52_1: R52.1 U11.2(~{RE}) U11.3(DE)
NetR55_1: R55.1 U12.2(~{RE}) U12.3(DE)
NetR58_1: R58.1 U13.2(~{RE}) U13.3(DE)
NetR61_1: R61.1 U14.2(~{RE}) U14.3(DE)
NetR64_1: R64.1 U15.2(~{RE}) U15.3(DE)
NetR79_1: R79.1 U16.2(~{RE}) U16.3(DE)
NetR82_1: R82.1 U17.2(~{RE}) U17.3(DE)
NetR85_1: R85.1 U18.2(~{RE}) U18.3(DE)
NetR88_1: R88.1 U19.2(~{RE}) U19.3(DE)
NetR91_1: R91.1 U20.2(~{RE}) U20.3(DE)

Not connected (* = marked no-connect by the designer): J1 16(MH1) 17(MH2); J2 16(MH1) 17(MH2); J3 16(MH1) 17(MH2); J4 16(MH1) 17(MH2); J5 16(MH1) 17(MH2); J6 16(MH1) 17(MH2); J7 16(MH1) 17(MH2); J8 16(MH1) 17(MH2); J9 16(MH1) 17(MH2); J10 16(MH1) 17(MH2); J11 16(MH1) 17(MH2); J12 16(MH1) 17(MH2); J13 16(MH1) 17(MH2); J14 16(MH1) 17(MH2); J15 16(MH1) 17(MH2); J16 16(MH1) 17(MH2); J17 16(MH1) 17(MH2); J18 16(MH1) 17(MH2); J19 16(MH1) 17(MH2); J20 16(MH1) 17(MH2); U21 2(3.3V) 3(GND) 8(PA8) 11(PA11) 12(PA12) 13(TDI/PA15) 14(TDO/PB3) 15(TRST/PB4) 16(PB5) 17(PB6) 21(VBAT) 22(PC13) 23(PC14) 24(PC15) 25(PA0) 26(PA1) 27(PA2) 28(PA3) 29(PA4) 30(PA5) 31(PA6) 32(PA7) 33(PB0) 34(PB1) 35(PB2) 39(VDDA) 40(3.3V); U22 2(3.3V) 3(GND) 8(PA8) 11(PA11) 12(PA12) 13(TDI/PA15) 14(TDO/PB3) 15(TRST/PB4) 16(PB5) 17(PB6) 21(VBAT) 22(PC13) 23(PC14) 24(PC15) 25(PA0) 26(PA1) 27(PA2) 28(PA3) 29(PA4) 30(PA5) 31(PA6) 32(PA7) 33(PB0) 34(PB1) 35(PB2) 39(VDDA) 40(3.3V); U23 2(3.3V) 3(GND) 8(PA8) 11(PA11) 12(PA12) 13(TDI/PA15) 14(TDO/PB3) 15(TRST/PB4) 16(PB5) 17(PB6) 21(VBAT) 22(PC13) 23(PC14) 24(PC15) 25(PA0) 26(PA1) 27(PA2) 28(PA3) 29(PA4) 30(PA5) 31(PA6) 32(PA7) 33(PB0) 34(PB1) 35(PB2) 39(VDDA) 40(3.3V); U24 2(3.3V) 3(GND) 8(PA8) 11(PA11) 12(PA12) 13(TDI/PA15) 14(TDO/PB3) 15(TRST/PB4) 16(PB5) 17(PB6) 21(VBAT) 22(PC13) 23(PC14) 24(PC15) 25(PA0) 26(PA1) 27(PA2) 28(PA3) 29(PA4) 30(PA5) 31(PA6) 32(PA7) 33(PB0) 34(PB1) 35(PB2) 39(VDDA) 40(3.3V); U25 2(3.3V) 3(GND) 8(PA8) 11(PA11) 12(PA12) 13(TDI/PA15) 14(TDO/PB3) 15(TRST/PB4) 16(PB5) 17(PB6) 21(VBAT) 22(PC13) 23(PC14) 24(PC15) 25(PA0) 26(PA1) 27(PA2) 28(PA3) 29(PA4) 30(PA5) 31(PA6) 32(PA7) 33(PB0) 34(PB1) 35(PB2) 39(VDDA) 40(3.3V); U26 2(3.3V) 3(GND) 8(PA8) 11(PA11) 12(PA12) 13(TDI/PA15) 14(TDO/PB3) 15(TRST/PB4) 16(PB5) 17(PB6) 21(VBAT) 22(PC13) 23(PC14) 24(PC15) 25(PA0) 26(PA1) 27(PA2) 28(PA3) 29(PA4) 30(PA5) 31(PA6) 32(PA7) 33(PB0) 34(PB1) 35(PB2) 39(VDDA) 40(3.3V); U27 2(3.3V) 3(GND) 8(PA8) 11(PA11) 12(PA12) 13(TDI/PA15) 14(TDO/PB3) 15(TRST/PB4) 16(PB5) 17(PB6) 21(VBAT) 22(PC13) 23(PC14) 24(PC15) 25(PA0) 26(PA1) 27(PA2) 28(PA3) 29(PA4) 30(PA5) 31(PA6) 32(PA7) 33(PB0) 34(PB1) 35(PB2) 39(VDDA) 40(3.3V); U28 2(3.3V) 3(GND) 8(PA8) 11(PA11) 12(PA12) 13(TDI/PA15) 14(TDO/PB3) 15(TRST/PB4) 16(PB5) 17(PB6) 21(VBAT) 22(PC13) 23(PC14) 24(PC15) 25(PA0) 26(PA1) 27(PA2) 28(PA3) 29(PA4) 30(PA5) 31(PA6) 32(PA7) 33(PB0) 34(PB1) 35(PB2) 39(VDDA) 40(3.3V); U29 2(3.3V) 3(GND) 8(PA8) 11(PA11) 12(PA12) 13(TDI/PA15) 14(TDO/PB3) 15(TRST/PB4) 16(PB5) 17(PB6) 21(VBAT) 22(PC13) 23(PC14) 24(PC15) 25(PA0) 26(PA1) 27(PA2) 28(PA3) 29(PA4) 30(PA5) 31(PA6) 32(PA7) 33(PB0) 34(PB1) 35(PB2) 39(VDDA) 40(3.3V); U30 2(3.3V) 3(GND) 8(PA8) 11(PA11) 12(PA12) 13(TDI/PA15) 14(TDO/PB3) 15(TRST/PB4) 16(PB5) 17(PB6) 21(VBAT) 22(PC13) 23(PC14) 24(PC15) 25(PA0) 26(PA1) 27(PA2) 28(PA3) 29(PA4) 30(PA5) 31(PA6) 32(PA7) 33(PB0) 34(PB1) 35(PB2) 39(VDDA) 40(3.3V); U31 2(3.3V) 3(GND) 8(PA8) 11(PA11) 12(PA12) 13(TDI/PA15) 14(TDO/PB3) 15(TRST/PB4) 16(PB5) 17(PB6) 21(VBAT) 22(PC13) 23(PC14) 24(PC15) 25(PA0) 26(PA1) 27(PA2) 28(PA3) 29(PA4) 30(PA5) 31(PA6) 32(PA7) 33(PB0) 34(PB1) 35(PB2) 39(VDDA) 40(3.3V); U32 2(3.3V) 3(GND) 8(PA8) 11(PA11) 12(PA12) 13(TDI/PA15) 14(TDO/PB3) 15(TRST/PB4) 16(PB5) 17(PB6) 21(VBAT) 22(PC13) 23(PC14) 24(PC15) 25(PA0) 26(PA1) 27(PA2) 28(PA3) 29(PA4) 30(PA5) 31(PA6) 32(PA7) 33(PB0) 34(PB1) 35(PB2) 39(VDDA) 40(3.3V); U33 2(3.3V) 3(GND) 8(PA8) 11(PA11) 12(PA12) 13(TDI/PA15) 14(TDO/PB3) 15(TRST/PB4) 16(PB5) 17(PB6) 21(VBAT) 22(PC13) 23(PC14) 24(PC15) 25(PA0) 26(PA1) 27(PA2) 28(PA3) 29(PA4) 30(PA5) 31(PA6) 32(PA7) 33(PB0) 34(PB1) 35(PB2) 39(VDDA) 40(3.3V); U34 2(3.3V) 3(GND) 8(PA8) 11(PA11) 12(PA12) 13(TDI/PA15) 14(TDO/PB3) 15(TRST/PB4) 16(PB5) 17(PB6) 21(VBAT) 22(PC13) 23(PC14) 24(PC15) 25(PA0) 26(PA1) 27(PA2) 28(PA3) 29(PA4) 30(PA5) 31(PA6) 32(PA7) 33(PB0) 34(PB1) 35(PB2) 39(VDDA) 40(3.3V); U35 2(3.3V) 3(GND) 8(PA8) 11(PA11) 12(PA12) 13(TDI/PA15) 14(TDO/PB3) 15(TRST/PB4) 16(PB5) 17(PB6) 21(VBAT) 22(PC13) 23(PC14) 24(PC15) 25(PA0) 26(PA1) 27(PA2) 28(PA3) 29(PA4) 30(PA5) 31(PA6) 32(PA7) 33(PB0) 34(PB1) 35(PB2) 39(VDDA) 40(3.3V); U36 2(3.3V) 3(GND) 8(PA8) 11(PA11) 12(PA12) 13(TDI/PA15) 14(TDO/PB3) 15(TRST/PB4) 16(PB5) 17(PB6) 21(VBAT) 22(PC13) 23(PC14) 24(PC15) 25(PA0) 26(PA1) 27(PA2) 28(PA3) 29(PA4) 30(PA5) 31(PA6) 32(PA7) 33(PB0) 34(PB1) 35(PB2) 39(VDDA) 40(3.3V); U37 2(3.3V) 3(GND) 8(PA8) 11(PA11) 12(PA12) 13(TDI/PA15) 14(TDO/PB3) 15(TRST/PB4) 16(PB5) 17(PB6) 21(VBAT) 22(PC13) 23(PC14) 24(PC15) 25(PA0) 26(PA1) 27(PA2) 28(PA3) 29(PA4) 30(PA5) 31(PA6) 32(PA7) 33(PB0) 34(PB1) 35(PB2) 39(VDDA) 40(3.3V); U38 2(3.3V) 3(GND) 8(PA8) 11(PA11) 12(PA12) 13(TDI/PA15) 14(TDO/PB3) 15(TRST/PB4) 16(PB5) 17(PB6) 21(VBAT) 22(PC13) 23(PC14) 24(PC15) 25(PA0) 26(PA1) 27(PA2) 28(PA3) 29(PA4) 30(PA5) 31(PA6) 32(PA7) 33(PB0) 34(PB1) 35(PB2) 39(VDDA) 40(3.3V); U39 2(3.3V) 3(GND) 8(PA8) 11(PA11) 12(PA12) 13(TDI/PA15) 14(TDO/PB3) 15(TRST/PB4) 16(PB5) 17(PB6) 21(VBAT) 22(PC13) 23(PC14) 24(PC15) 25(PA0) 26(PA1) 27(PA2) 28(PA3) 29(PA4) 30(PA5) 31(PA6) 32(PA7) 33(PB0) 34(PB1) 35(PB2) 39(VDDA) 40(3.3V); U40 2(3.3V) 3(GND) 8(PA8) 11(PA11) 12(PA12) 13(TDI/PA15) 14(TDO/PB3) 15(TRST/PB4) 16(PB5) 17(PB6) 21(VBAT) 22(PC13) 23(PC14) 24(PC15) 25(PA0) 26(PA1) 27(PA2) 28(PA3) 29(PA4) 30(PA5) 31(PA6) 32(PA7) 33(PB0) 34(PB1) 35(PB2) 39(VDDA) 40(3.3V)

## Library data of the parts
1 2 = 0805 翠绿: 发光二极管; ComponentLink1Description: 供应商链接; ComponentLink1URL: http://www.szlcsc.com/product/details_2670.html; Package: 0805; Supplier: LC; SuppliersPartNumber: C2297
BX1-BX20 = 1206 0Ω (0R0) 1%: 贴片电阻; ComponentLink1Description: 供应商链接; ComponentLink1URL: http://www.szlcsc.com/product/details_18576.html; Package: 1206; Supplier: LC; SuppliersPartNumber: C17888
C1-C80 = Cap Semi: Capacitor (Semiconductor SIM Model); Published: 8-Jun-2000; LatestRevisionDate: 29-May-2009; LatestRevisionNote: IPC-7351 Footprint Added.; PackageReference: C1206; Publisher: Altium Limited; PackageDescription: Chip Capacitor
D16 = D Varactor: Variable Capacitance Diode; Note: Pin 2 is not connected and not drawn.; Published: 8-Jun-2000; LatestRevisionDate: 29-May-2009; LatestRevisionNote: IPC-7351 Footprint Added.; DatasheetVersion: Jan-1998; PackageVersion: 1996; PackageReference: SOT23A; Publisher: Altium Limited; PackageDescription: 3-Pin SOT-23 Package 0.95 mm Pitch, 2.3 mm Lead Span - Reverse Pinning; ComponentLink1Description: Manufacturer Link; ComponentLink1URL: http://www.zetex.com/
D17 D18 = Diode 1N4007: 1 Amp General Purpose Rectifier; Published: 8-Jun-2000; LatestRevisionDate: 17-Jul-2002; LatestRevisionNote: Re-released for DXP Platform.; DatasheetVersion: 1998; PackageVersion: Aug-1999; PackageReference: DO-41; Publisher: Altium Limited; PackageDescription: Diode, Axial; Body 5.2 x 2.7 mm (LxDia. max), Lead Dia. 0.86 mm (max); Code_JEDEC: DO-204-AL; ComponentLink1Description: Manufacturer Link; ComponentLink1URL: http://www.fairchildsemi.com/; ComponentLink2Description: Datasheet; ComponentLink2URL: http://www.fairchildsemi.com/ds/1N%2F1N4001.pdf
G1 = GDT
J1-J20 = Connector 15: Receptacle Assembly, 15-Pin, Sim Line Connector; PackageDocument: B; Positions: 15; Gender: Receptacle Header; Published: 15-Jun-2001; LatestRevisionDate: 17-Jul-2002; LatestRevisionNote: Re-released for DXP Platform.; DatasheetDocument: 24-Nov-1999; PackageReference: 788574; Publisher: Altium Limited; Orientation: Right Angle
P1-P5 = Header 2: Header, 2-Pin; LatestRevisionDate: 17-Jul-2002; LatestRevisionNote: Re-released for DXP Platform.; Publisher: Altium Limited
R1-R75 R78-R102 RP1 = Res_: 电阻
R76 R77 = Res2: Resistor; Published: 8-Jun-2000; LatestRevisionDate: 17-Jul-2002; LatestRevisionNote: Re-released for DXP Platform.; PackageReference: AXIAL-0.4; Publisher: Altium Limited; PackageDescription: Axial Device, Thru-Hole; 2 Leads; 0.4 in Pin Spacing
RD1 = 0805 2.2KΩ (2201) 1%: 贴片电阻; ComponentLink1Description: 供应商链接; ComponentLink1URL: http://www.szlcsc.com/product/details_18208.html; Package: 0805; Supplier: LC; SuppliersPartNumber: C17520
RD2 = 0805 24KΩ (2402) 1%: 贴片电阻; ComponentLink1Description: 供应商链接; ComponentLink1URL: http://www.szlcsc.com/product/details_18263.html; Package: 0805; Supplier: LC; SuppliersPartNumber: C17575
T1 = Trans Ideal: Transformer (Ideal); Published: 8-Jun-2000; LatestRevisionDate: 17-Jul-2002; LatestRevisionNote: Re-released for DXP Platform.; PackageReference: TRF_4; Publisher: Altium Limited; PackageDescription: Transformer; 4 Leads
U1-U20 = SP3485
U21-U40 = MCU: 优信尺寸30.77*58.71